# Altium schematic sheet Voltages.SchDoc: Title
size A4; SchTemplateVer: V2.0; Author: Adam Mizerkiewicz; CompanyName: Adam Mizerkiewicz; DrawnBy: Adam Mizerkiewicz; Engineer: Adam Mizerkiewicz; Organization: Adam Mizerkiewicz; Address1: Sarnia 2/19; Address2: 61-058 Poznań; Revision: 0.0
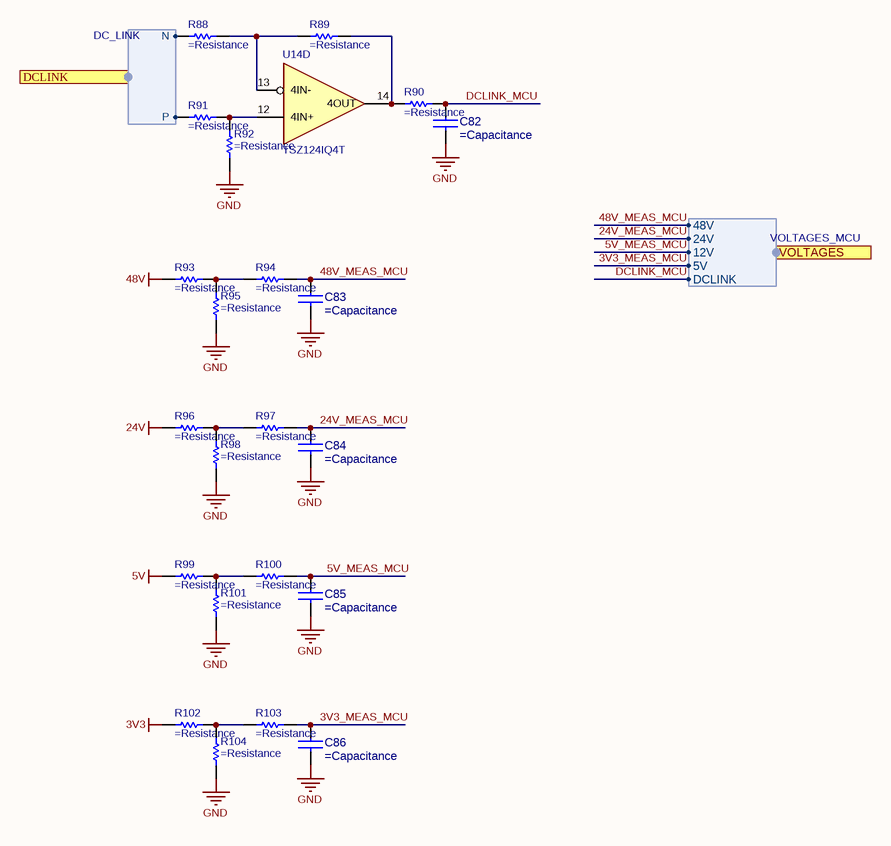
[diagram p0: Voltages.SchDoc]

## Parts
C82  (no value)  [C0402]
C83  (no value)  [C0402]
C84  (no value)  [C0402]
C85  (no value)  [C0402]
C86  (no value)  [C0402]
R88  (no value)  [R0402]
R89  (no value)  [R0402]
R90  (no value)  [R0402]
R91  (no value)  [R0402]
R92  (no value)  [R0402]
R93  (no value)  [R0402]
R94  (no value)  [R0402]
R95  (no value)  [R0402]
R96  (no value)  [R0402]
R97  (no value)  [R0402]
R98  (no value)  [R0402]
R99  (no value)  [R0402]
R100  (no value)  [R0402]
R101  (no value)  [R0402]
R102  (no value)  [R0402]
R103  (no value)  [R0402]
R104  (no value)  [R0402]
U14  TSZ124IQ4T  [VQFN16]  (part D of 5)

## Ports
DCLINK (harness DC_LINK), VOLTAGES (harness VOLTAGES_MCU)

## Harnesses
VOLTAGES_MCU: 24V, 12V, 5V, DCLINK, 48V
DC_LINK: N, P

## Nets
3V3: R102.1
5V: R99.1
24V: R96.1
48V: R93.1
GND: C82.2 C83.2 C84.2 C85.2 C86.2 R92.1 R95.1 R98.1 R101.1 R104.1
3V3_MEAS_MCU: C86.1 R103.2 ; port VOLTAGES.5V
5V_MEAS_MCU: C85.1 R100.2 ; port VOLTAGES.12V
24V_MEAS_MCU: C84.1 R97.2 ; port VOLTAGES.24V
48V_MEAS_MCU: C83.1 R94.2 ; port VOLTAGES.48V
DCLINK_MCU: C82.1 R90.2 ; port VOLTAGES.DCLINK
NetR88_1: R88.1 ; port DCLINK.N
NetR88_2: R88.2 R89.1 U14.13(4IN-)
NetR89_2: R89.2 R90.1 U14.14(4OUT)
NetR91_1: R91.1 ; port DCLINK.P
NetR91_2: R91.2 R92.2 U14.12(4IN+)
NetR93_2: R93.2 R94.1 R95.2
NetR96_2: R96.2 R97.1 R98.2
NetR99_2: R99.2 R100.1 R101.2
NetR102_2: R102.2 R103.1 R104.2

## Notes on the sheet
- Revision
  =Revision
- Sheet
  =SheetNumber / =SheetTotal

## Library data of the parts
C82-C86 = CAP0402-6.8nF-25V: Multilayer Ceramic Capacitors MLCC - SMD/SMT 25V 6800pF X7R 0402 10% AEC-Q200; Manufacturer: KEMET; Manufacturer Part Number: C0402C682K3RACAUTO; Capacitance: 6.8nF; Value: 6.8nF; Supplier 1: DigiKey; Supplier Part Number 1: 399-C0402C682K3RACAUTOCT-ND; Supplier: DigiKey; Supplier Part Number: 399-C0402C682K3RACAUTOCT-ND; RoHS: Compliant; Category: Ceramic Capacitors; Stock: 9600; Pricing: 1=0,26, 10=0,122, 50=0,075, 100=0,0595, 500=0,0515 (USD); Case/Package: 0402; China RoHS: Compliant; Dielectric: X7R; Dielectric Material: Ceramic; Height: 500µm; Length: 1mm; Lifecycle Status: Production; Material: Ceramic; Max Operating Temperature: 125°C; Min Operating Temperature: -55°C; Mounting Technology: Surface Mount; Pins: 2; Number of Terminals: 2; REACH SVHC: Yes; Voltage Rating: 25V; Voltage Rating (DC): 25V; Width: 500µm; ComponentLink1URL: https://datasheet.octopart.com:443/C0402C682K3RACAUTO-KEMET-datasheet-178087915.pdf?src-supplier=IHS; ComponentLink1Description: https://datasheet.octopart.com:443/C0402C682K3RACAUTO-KEMET-datasheet-178087915.pdf?src-supplier=IHS; ComponentLink2URL: https://datasheet.octopart.com:443/C0402C682K3RACAUTO-KEMET-datasheet-137357759.pdf?src-supplier=Upverter; ComponentLink2Description: https://datasheet.octopart.com:443/C0402C682K3RACAUTO-KEMET-datasheet-137357759.pdf?src-supplier=Upverter; ComponentLink3URL: https://datasheet.octopart.com:443/C0402C682K3RACAUTO-KEMET-datasheet-153706760.pdf?src-supplier=Electro+Sonic; ComponentLink3Description: https://datasheet.octopart.com:443/C0402C682K3RACAUTO-KEMET-datasheet-153706760.pdf?src-supplier=Electro+Sonic; ComponentLink4URL: https://datasheet.octopart.com:443/C0402C682K3RACAUTO-KEMET-datasheet-138896278.pdf?src-supplier=Farnell; ComponentLink4Description: https://datasheet.octopart.com:443/C0402C682K3RACAUTO-KEMET-datasheet-138896278.pdf?src-supplier=Farnell; ComponentLink5URL: https://datasheet.octopart.com/C0402C682K3RACAUTO-KEMET-datasheet-84169754.pdf; ComponentLink5Description: https://datasheet.octopart.com/C0402C682K3RACAUTO-KEMET-datasheet-84169754.pdf
R88 R90 R91 = RES0402-1k-1%: Res Thick Film 0402 1K Ohm 1% 0.063W(1/16W) ±50ppm/C Pad SMD Automotive T/R; Manufacturer: Vishay; Manufacturer Part Number: CRCW04021K00FHEDP; Resistance: 1kΩ; Max Power Dissipation: 63mW; Value: 1kΩ; Temperature Coefficient: 50ppm/°C; Voltage Rating: 50V; Supplier 1: DigiKey; Supplier Part Number 1: CRCW04021K00FHEDP-ND; Supplier: DigiKey; Supplier Part Number: CRCW04021K00FHEDP-ND; RoHS: Compliant; Category: Chip SMD Resistors; Pricing: 10000=0,03252 (USD); Case/Package: 0402; China RoHS: Non-Compliant; Composition: Thick Film; Contact Plating: Tin; Depth: 500µm; Features: Automotive AEC-Q200; Height: 350µm; Length: 990.6µm; Lifecycle Status: Production; Max Operating Temperature: 155°C; Military Standard: Not; Min Operating Temperature: -55°C; Mounting Technology: Surface Mount; Number of Terminals: 2; Number of Terminations: 2; Packaging: Tape & Reel; Power Dissipation: 63mW; Power Rating: 63mW; Radiation Hardening: No; REACH SVHC: Yes; Tolerance: 1%; Width: 500µm; Working Voltage: 50V; ComponentLink1URL: https://datasheet.octopart.com:443/CRCW04021K00FHEDP-Vishay-datasheet-182027415.pdf?src-supplier=IHS; ComponentLink1Description: https://datasheet.octopart.com:443/CRCW04021K00FHEDP-Vishay-datasheet-182027415.pdf?src-supplier=IHS; ComponentLink2URL: https://datasheet.octopart.com:443/CRCW04021K00FHEDP-Vishay-Dale-datasheet-141207190.pdf?src-supplier=Upverter; ComponentLink2Description: https://datasheet.octopart.com:443/CRCW04021K00FHEDP-Vishay-Dale-datasheet-141207190.pdf?src-supplier=Upverter; ComponentLink3URL: http://sigma.octopart.com:80/rohs_statement/Vishay-company-15.pdf?src-supplier=Compliance+Statements; ComponentLink3Description: http://sigma.octopart.com:80/rohs_statement/Vishay-company-15.pdf?src-supplier=Compliance+Statements
R89 R92 R95 R98 = RES0402-2k-1%: Res Thick Film 0402 2K Ohm 1% 1/16W 100ppm/C Molded SMD SMD Paper T/R; Manufacturer: Vishay; Manufacturer Part Number: CRCW04022K00FKEE; Resistance: 2kΩ; Max Power Dissipation: 63mW; Value: 2kΩ; Temperature Coefficient: 100ppm/°C; Voltage Rating: 50V; Supplier 1: DigiKey; Supplier Part Number 1: 541-CRCW04022K00FKEECT-ND; Supplier: DigiKey; Supplier Part Number: 541-CRCW04022K00FKEECT-ND; RoHS: Compliant; Category: Chip SMD Resistors; Stock: 10445; Pricing: 1=0,1, 10=0,03, 25=0,0224, 50=0,018, 100=0,0148, 250=0,01156, 500=0,01056, 1000=0,0084, 5000=0,00637 (USD); Case/Package: 0402; China RoHS: Non-Compliant; Composition: Thick Film; Contact Plating: Tin; Features: Automotive AEC-Q200; Height: 350µm; Lead Free: Lead Free; Length: 990.6µm; Lifecycle Status: Production; Max Operating Temperature: 155°C; Min Operating Temperature: -55°C; Mounting Technology: Surface Mount; Number of Terminals: 2; Number of Terminations: 2; Packaging: Tape & Reel; Power Dissipation: 63mW; Power Rating: 63mW; Radiation Hardening: No; REACH SVHC: Yes; Tolerance: 1%; Width: 500µm; Working Voltage: 50V; ComponentLink1URL: https://datasheet.octopart.com:443/CRCW04022K00FKEE-Vishay-datasheet-175423584.pdf?src-supplier=IHS; ComponentLink1Description: https://datasheet.octopart.com:443/CRCW04022K00FKEE-Vishay-datasheet-175423584.pdf?src-supplier=IHS; ComponentLink2URL: https://datasheet.octopart.com/D-CRCW-e3-Standard-Thick-Film-Chip-Resistors-Vishay-datasheet-family-64.pdf; ComponentLink2Description: https://datasheet.octopart.com/D-CRCW-e3-Standard-Thick-Film-Chip-Resistors-Vishay-datasheet-family-64.pdf; ComponentLink3URL: http://sigma.octopart.com:80/rohs_certificate/D-CRCW-e3-Standard-Thick-Film-Chip-Resistors-Vishay-family-102.pdf?src-supplier=Compliance+Statements; ComponentLink3Description: http://sigma.octopart.com:80/rohs_certificate/D-CRCW-e3-Standard-Thick-Film-Chip-Resistors-Vishay-family-102.pdf?src-supplier=Compliance+Statements
R93 = RES0402-47k-1%: Res Thick Film 0402 47K Ohm 1% 0.063W(1/16W) ±100ppm/C Pad SMD T/R; Manufacturer: Vishay; Manufacturer Part Number: CRCW040247K0FKEDC; Resistance: 47kΩ; Power Dissipation: 63mW; Value: 47kΩ; Temperature Coefficient: 100ppm/°C; Voltage Rating: 50V; Supplier 1: DigiKey; Supplier Part Number 1: 541-3966-1-ND; Supplier: DigiKey; Supplier Part Number: 541-3966-1-ND; RoHS: Compliant; Category: Chip SMD Resistors; Stock: 190917; Pricing: 1=0,1, 10=0,028, 25=0,0208, 50=0,0168, 100=0,0138, 250=0,01072, 500=0,009, 1000=0,00766, 5000=0,00554 (USD); Case/Package: 0402; China RoHS: Non-Compliant; Composition: Thick Film; Contact Plating: Tin; Height: 300µm; Lead Free: Lead Free; Length: 1mm; Lifecycle Status: Production; Max Operating Temperature: 155°C; Min Operating Temperature: -55°C; Mounting Technology: Surface Mount; Number of Terminals: 2; Power Rating: 63mW; REACH SVHC: Yes; Schedule B: 8533210045, 8533210045|8533210045|8533210045|8533210045|8533210045|8533210045|8533210045|8533210045|8533210045|8533210045|8533210045|8533210045|8533210045|8533210045|8533210045|8533210045|8533210045|8533210045|8533210045|8533210045|8533210045|8533210045|8533210045|85; Termination: Wraparound; Tolerance: 1%; Width: 500µm; Working Voltage: 50V; ComponentLink1URL: https://datasheet.octopart.com:443/CRCW040247K0FKEDC-Vishay-datasheet-102570912.pdf?src-supplier=Future+Electronics; ComponentLink1Description: https://datasheet.octopart.com:443/CRCW040247K0FKEDC-Vishay-datasheet-102570912.pdf?src-supplier=Future+Electronics; ComponentLink2URL: https://datasheet.octopart.com:443/CRCW040247K0FKEDC-Vishay-datasheet-62316122.pdf?src-supplier=Future+Electronics; ComponentLink2Description: https://datasheet.octopart.com:443/CRCW040247K0FKEDC-Vishay-datasheet-62316122.pdf?src-supplier=Future+Electronics; ComponentLink3URL: https://datasheet.octopart.com:443/CRCW040247K0FKEDC-Vishay-datasheet-175423585.pdf?src-supplier=IHS; ComponentLink3Description: https://datasheet.octopart.com:443/CRCW040247K0FKEDC-Vishay-datasheet-175423585.pdf?src-supplier=IHS; ComponentLink4URL: http://sigma.octopart.com:80/rohs_statement/Vishay-company-15.pdf?src-supplier=Compliance+Statements; ComponentLink4Description: http://sigma.octopart.com:80/rohs_statement/Vishay-company-15.pdf?src-supplier=Compliance+Statements
R94 R97 R100 R102-R104 = RES0402-10k-1%: Res Thick Film 0402 10K Ohm 1% 0.063W(1/16W) ±100ppm/C Pad SMD T/R Automotive AEC-Q200; Manufacturer: Vishay; Manufacturer Part Number: CRCW040210K0FKEE; Resistance: 10kΩ; Max Power Dissipation: 63mW; Value: 10kΩ; Temperature Coefficient: 100ppm/°C; Voltage Rating: 50V; Supplier 1: DigiKey; Supplier Part Number 1: 541-2954-1-ND; Supplier: DigiKey; Supplier Part Number: 541-2954-1-ND; RoHS: Compliant; Category: Chip SMD Resistors; Pricing: 1=0,1, 10=0,03, 25=0,0224, 50=0,018, 100=0,0148, 250=0,01156, 500=0,00974, 1000=0,00832, 5000=0,00637 (USD); Case/Package: 0402; Case Code (Imperial): 0402; Case Code (Metric): 1005; China RoHS: Non-Compliant; Composition: Thick Film; Contact Plating: Tin; Depth: 500µm; Features: Automotive AEC-Q200; Height: 350µm; Lead Free: Lead Free; Length: 990.6µm; Lifecycle Status: Production; Max Operating Temperature: 155°C; Military Standard: Not; Min Operating Temperature: -55°C; Mounting Technology: Surface Mount; Number of Terminals: 2; Number of Terminations: 2; Packaging: Tape & Reel; Power Dissipation: 63mW; Power Rating: 63mW; Radiation Hardening: No; REACH SVHC: Yes; Schedule B: 8533210045, 8533210045|8533210045|8533210045|8533210045|8533210045|8533210045|8533210045|8533210045|8533210045|8533210045|8533210045|8533210045|8533210045|8533210045|8533210045|8533210045|8533210045|8533210045|8533210045|8533210045|8533210045|8533210045|8533210045|85; Tolerance: 1%; Voltage Rating (DC): 50V; Width: 500µm; Working Voltage: 50V; ComponentLink1URL: https://datasheet.octopart.com:443/CRCW040210K0FKEE-Vishay-datasheet-175423584.pdf?src-supplier=IHS; ComponentLink1Description: https://datasheet.octopart.com:443/CRCW040210K0FKEE-Vishay-datasheet-175423584.pdf?src-supplier=IHS; ComponentLink2URL: https://datasheet.octopart.com:443/CRCW040210K0FKEE-Vishay-datasheet-62316122.pdf?src-supplier=Future+Electronics; ComponentLink2Description: https://datasheet.octopart.com:443/CRCW040210K0FKEE-Vishay-datasheet-62316122.pdf?src-supplier=Future+Electronics; ComponentLink3URL: http://sigma.octopart.com:80/rohs_statement/Vishay-company-15.pdf?src-supplier=Compliance+Statements; ComponentLink3Description: http://sigma.octopart.com:80/rohs_statement/Vishay-company-15.pdf?src-supplier=Compliance+Statements
R96 R99 = RES0402-20k-1%: Res Thick Film 0402 20K Ohm 1% 0.063W(1/16W) ±100ppm/C Pad SMD T/R; Manufacturer: Vishay; Manufacturer Part Number: CRCW040220K0FKEDC; Resistance: 20kΩ; Power Dissipation: 63mW; Value: 20kΩ; Temperature Coefficient: 100ppm/°C; Voltage Rating: 50V; Supplier 1: DigiKey; Supplier Part Number 1: 541-3969-1-ND; Supplier: DigiKey; Supplier Part Number: 541-3969-1-ND; RoHS: Compliant; Category: Chip SMD Resistors; Stock: 7862; Pricing: 1=0,1, 10=0,028, 25=0,0208, 50=0,0168, 100=0,0138, 250=0,01072, 500=0,009, 1000=0,00766, 5000=0,00554 (USD); Case/Package: 0402; China RoHS: Non-Compliant; Composition: Thick Film; Contact Plating: Tin; Height: 300µm; Lead Free: Lead Free; Length: 1mm; Lifecycle Status: Production; Max Operating Temperature: 155°C; Min Operating Temperature: -55°C; Mounting Technology: Surface Mount; Number of Terminals: 2; Power Rating: 63mW; REACH SVHC: Yes; Schedule B: 8533210045, 8533210045|8533210045|8533210045|8533210045|8533210045; Termination: Wraparound; Tolerance: 1%; Width: 500µm; Working Voltage: 50V; ComponentLink1URL: https://datasheet.octopart.com:443/CRCW040220K0FKEDC-Vishay-datasheet-102570912.pdf?src-supplier=Upverter; ComponentLink1Description: https://datasheet.octopart.com:443/CRCW040220K0FKEDC-Vishay-datasheet-102570912.pdf?src-supplier=Upverter; ComponentLink2URL: https://datasheet.octopart.com:443/CRCW040220K0FKEDC-Vishay-datasheet-175423585.pdf?src-supplier=IHS; ComponentLink2Description: https://datasheet.octopart.com:443/CRCW040220K0FKEDC-Vishay-datasheet-175423585.pdf?src-supplier=IHS; ComponentLink3URL: https://datasheet.octopart.com:443/CRCW040220K0FKEDC-Vishay-datasheet-100063072.pdf?src-supplier=Future+Electronics; ComponentLink3Description: https://datasheet.octopart.com:443/CRCW040220K0FKEDC-Vishay-datasheet-100063072.pdf?src-supplier=Future+Electronics; ComponentLink4URL: https://datasheet.octopart.com:443/CRCW040220K0FKEDC-Vishay-datasheet-62316122.pdf?src-supplier=Future+Electronics; ComponentLink4Description: https://datasheet.octopart.com:443/CRCW040220K0FKEDC-Vishay-datasheet-62316122.pdf?src-supplier=Future+Electronics; ComponentLink5URL: http://sigma.octopart.com:80/rohs_statement/Vishay-company-15.pdf?src-supplier=Compliance+Statements; ComponentLink5Description: http://sigma.octopart.com:80/rohs_statement/Vishay-company-15.pdf?src-supplier=Compliance+Statements
R101 = RES0402-30k-1%: 0402 30K Ohms 1% High Power Thick Film Surface Mount Chip Resistor; Manufacturer: Vishay; Manufacturer Part Number: CRCW040230K0FKEDHP; Manufacturer Package Identifier: CRCW0402-HPe3; Resistance: 30kΩ; Max Power Dissipation: 125mW; Power Dissipation: 200mW; Value: 30kΩ; Temperature Coefficient: 100ppm/°C; Voltage Rating: 50V; Supplier 1: DigiKey; Supplier Part Number 1: CRCW040230K0FKEDHPCT-ND; Supplier: DigiKey; Supplier Part Number: CRCW040230K0FKEDHPCT-ND; RoHS: Compliant; Category: Chip SMD Resistors; Stock: 9449; Pricing: 1=0,13, 10=0,061, 25=0,0472, 50=0,0392, 100=0,0331, 250=0,027, 500=0,0235, 1000=0,02072, 5000=0,01631 (USD); Case/Package: 0402; Case Code (Imperial): 0402; Case Code (Metric): 1005; China RoHS: Non-Compliant; Composition: Thick Film; Contact Plating: Tin; Features: Automotive AEC-Q200; Height: 300µm; Lead Free: Lead Free; Length: 990.6µm; Lifecycle Status: Production; Max Operating Temperature: 155°C; Min Operating Temperature: -55°C; Mounting Technology: Surface Mount; Number of Terminals: 2; Number of Terminations: 2; Packaging: Digi-Reel®; Power Rating: 200mW; Radiation Hardening: No; REACH SVHC: Yes; Tolerance: 1%; Width: 500µm; Working Voltage: 50V; ComponentLink1URL: https://datasheet.octopart.com/CRCW040230K0FKEDHP-Vishay-datasheet-83567917.pdf; ComponentLink1Description: https://datasheet.octopart.com/CRCW040230K0FKEDHP-Vishay-datasheet-83567917.pdf; ComponentLink2URL: https://datasheet.octopart.com/D-CRCW-e3-Standard-Thick-Film-Chip-Resistors-Vishay-datasheet-family-64.pdf; ComponentLink2Description: https://datasheet.octopart.com/D-CRCW-e3-Standard-Thick-Film-Chip-Resistors-Vishay-datasheet-family-64.pdf; ComponentLink3URL: https://datasheet.octopart.com:443/CRCW040230K0FKEDHP-Vishay-datasheet-137113427.pdf?src-supplier=X-ON; ComponentLink3Description: https://datasheet.octopart.com:443/CRCW040230K0FKEDHP-Vishay-datasheet-137113427.pdf?src-supplier=X-ON; ComponentLink4URL: https://datasheet.octopart.com:443/CRCW040230K0FKEDHP-Vishay-datasheet-62316122.pdf?src-supplier=Future+Electronics; ComponentLink4Description: https://datasheet.octopart.com:443/CRCW040230K0FKEDHP-Vishay-datasheet-62316122.pdf?src-supplier=Future+Electronics; ComponentLink5URL: http://sigma.octopart.com:80/rohs_certificate/D-CRCW-e3-Standard-Thick-Film-Chip-Resistors-Vishay-family-102.pdf?src-supplier=Compliance+Statements; ComponentLink5Description: http://sigma.octopart.com:80/rohs_certificate/D-CRCW-e3-Standard-Thick-Film-Chip-Resistors-Vishay-family-102.pdf?src-supplier=Compliance+Statements
U14 = TSZ124IQ4T: TSZ124 Series 5.5V 400 kHz Rail to Rail SMT Operational Amplifier - TSSOP-14; Manufacturer: STMicroelectronics; Bandwidth: 400kHz; Common Mode Rejection Ratio: 115dB; Input Bias Current: 200pA; Input Offset Voltage (Vos): 8µV; Max Supply Current: 40µA; Max Supply Voltage: 6V; Min Supply Voltage: 1.8V; Nominal Supply Current: 31µA; Number of Channels: 4; Operating Supply Voltage: 3.3V; Output Current: 17mA; Output Current per Channel: 18mA; Slew Rate: 0.19V/µs; Voltage Gain: 135dB; Supplier 1: DigiKey; Supplier Part Number 1: 497-14337-1-ND; Supplier: DigiKey; Supplier Part Number: 497-14337-1-ND; Manufacturer Part Number: TSZ124IQ4T; RoHS: Compliant; Category: Amplifiers - Op Amps, Buffer, Instrumentation; Stock: 10565; Pricing: 1=1,86, 10=1,367, 25=1,2444, 100=1,1092, 250=1,0448, 500=1,00596, 1000=0,97398 (USD); Case/Package: QFN; China RoHS: Compliant; Gain Bandwidth Product: 400kHz; Height - Seated (Max): 1mm; Length: 3mm; Lifecycle Status: Production; Max Operating Temperature: 125°C; Min Operating Temperature: -40°C; Mounting Technology: Surface Mount; Number of Circuits: 4; Pins: 16; Number of Terminals: 4; Operating Supply Current: 31µA; Packaging: Tape and Reel; REACH SVHC: Yes; Schedule B: 8542330000, 8542330000|8542330000|8542330000|8542330000|8542330000; Terminal Pitch: 500µm; Unity Gain Bandwidth Product: 400kHz; Width: 3mm; ComponentLink1URL: https://datasheet.octopart.com:443/TSZ124IQ4T-STMicroelectronics-datasheet-62337710.pdf?src-supplier=Future+Electronics; ComponentLink1Description: https://datasheet.octopart.com:443/TSZ124IQ4T-STMicroelectronics-datasheet-62337710.pdf?src-supplier=Future+Electronics; ComponentLink2URL: https://datasheet.octopart.com:443/TSZ124IQ4T-STMicroelectronics-datasheet-16350222.pdf?src-supplier=STMicroelectronics; ComponentLink2Description: https://datasheet.octopart.com:443/TSZ124IQ4T-STMicroelectronics-datasheet-16350222.pdf?src-supplier=STMicroelectronics; ComponentLink3URL: https://datasheet.octopart.com:443/TSZ124IQ4T-STMicroelectronics-datasheet-140259870.pdf?src-supplier=Farnell; ComponentLink3Description: https://datasheet.octopart.com:443/TSZ124IQ4T-STMicroelectronics-datasheet-140259870.pdf?src-supplier=Farnell; ComponentLink4URL: https://datasheet.octopart.com:443/TSZ124IQ4T-STMicroelectronics-datasheet-159009515.pdf?src-supplier=SHENGYU+ELECTRONICS; ComponentLink4Description: https://datasheet.octopart.com:443/TSZ124IQ4T-STMicroelectronics-datasheet-159009515.pdf?src-supplier=SHENGYU+ELECTRONICS; ComponentLink5URL: https://datasheet.octopart.com:443/TSZ124IQ4T-STMicroelectronics-datasheet-165583692.pdf?src-supplier=TME; ComponentLink5Description: https://datasheet.octopart.com:443/TSZ124IQ4T-STMicroelectronics-datasheet-165583692.pdf?src-supplier=TME